# Altium schematic sheet Sheet1.SchDoc
size A4; Organization: Altium Limited; Address1: L3, 12a Rodborough Rd; Address2: Frenchs Forest; Address3: NSW; Address4: Australia 2086
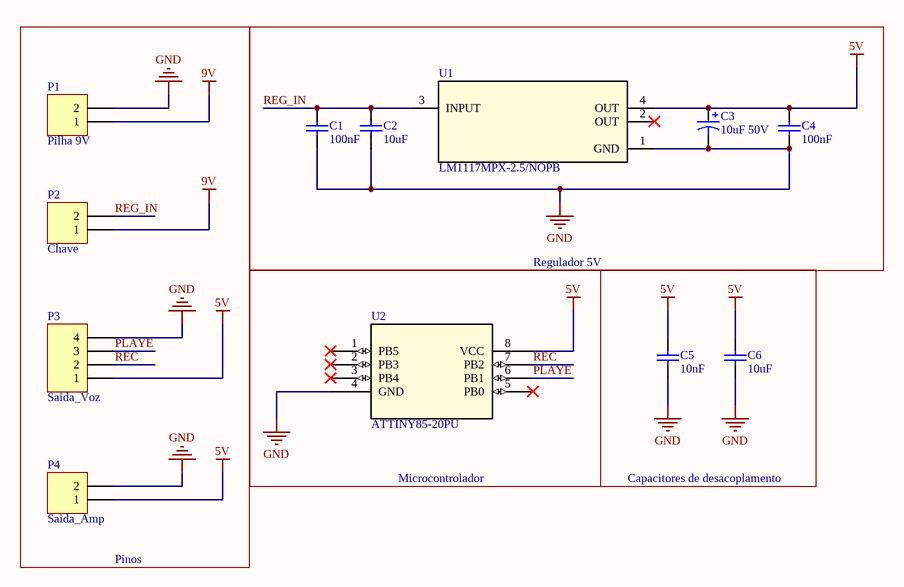
[diagram p0: Sheet1.SchDoc]

## Parts
C1  value 100nF  [C2012[0805]]  (hidden comment: Capacitor)
C2  value 10uF  [C2012[0805]]  (hidden comment: Capacitor)
C3  value 10uF 50V  [Cap_Al_SMD_B6_5.3x5.3mm]  (hidden comment: Capacitor Pol)
C4  value 100nF  [C2012[0805]]  (hidden comment: Capacitor)
C5  value 10nF  [C2012[0805]]  (hidden comment: Capacitor)
C6  value 10uF  [C2012[0805]]  (hidden comment: Capacitor)
P1  Pilha 9V  [HDR1X2]
P2  Chave  [HDR1X2]
P3  Saida_Voz  [HDR1X4]
P4  Saida_Amp  [HDR1X2]
U1  LM1117MPX-2.5/NOPB  [DCY0004A_N]
U2  ATTINY85-20PU  [8P3_ATM]

## Blocks framed on the sheet
Pinos: P1-P4
Regulador 5V: C1-C4 U1
Capacitores de desacoplamento: C5 C6

## Nets
5V: C3.1 C4.1 C5.2 C6.2 P3.1 P4.1 U1.4(OUT) U2.8(VCC)
9V: P1.1 P2.1
GND: C1.1 C2.1 C3.2 C4.2 C5.1 C6.1 P1.2 P3.4 P4.2 U1.1(GND) U2.4(GND)
PLAYE: P3.3 U2.6(PB1)
REC: P3.2 U2.7(PB2)
REG_IN: C1.2 C2.2 P2.2 U1.3(INPUT)

Not connected (* = marked no-connect by the designer): U1 2(OUT)*; U2 1(PB5)* 2(PB3)* 3(PB4)* 5(PB0)*

## Notes on the sheet
- Microcontrolador
- Title
- Size:
- Date:
- A4
- Number:
- Time:
- Revision:
- Sheet
- of
- File:

## Library data of the parts
C1 C2 C4-C6 = C: Manufacturer: *; PartNumber: *; Package Type: 0805
C3 = CP: Polarized Capacitor; Manufacturer: *; PartNumber: *; Package Type: 5.3x5.3
P1 P2 P4 = Header 2: Header, 2-Pin; LatestRevisionDate: 17-Jul-2002; LatestRevisionNote: Re-released for DXP Platform.; Publisher: Altium Limited
P3 = Header 4: Header, 4-Pin; LatestRevisionDate: 17-Jul-2002; LatestRevisionNote: Re-released for DXP Platform.; Publisher: Altium Limited
U1 = LM1117MPX-2.5/NOPB: No Description Available; Mfr_Name: Texas Instruments; Type: DEV; RefDes: RefDes; Copyright: Copyright (C) 2021 Ultra Librarian. All rights reserved.; Manufacturer_Part_Number: LM1117MPX-2.5/NOPB
U2 = ATTINY85-20PU: No Description Available; Mfr_Name: Microchip; Copyright: Copyright (C) 2021 Ultra Librarian. All rights reserved.; Manufacturer_Part_Number: ATTINY85-20PU; RefDes: RefDes; Type: DEV